# Altium schematic sheet smartGarden_Per_Rev01.SchDoc
size A
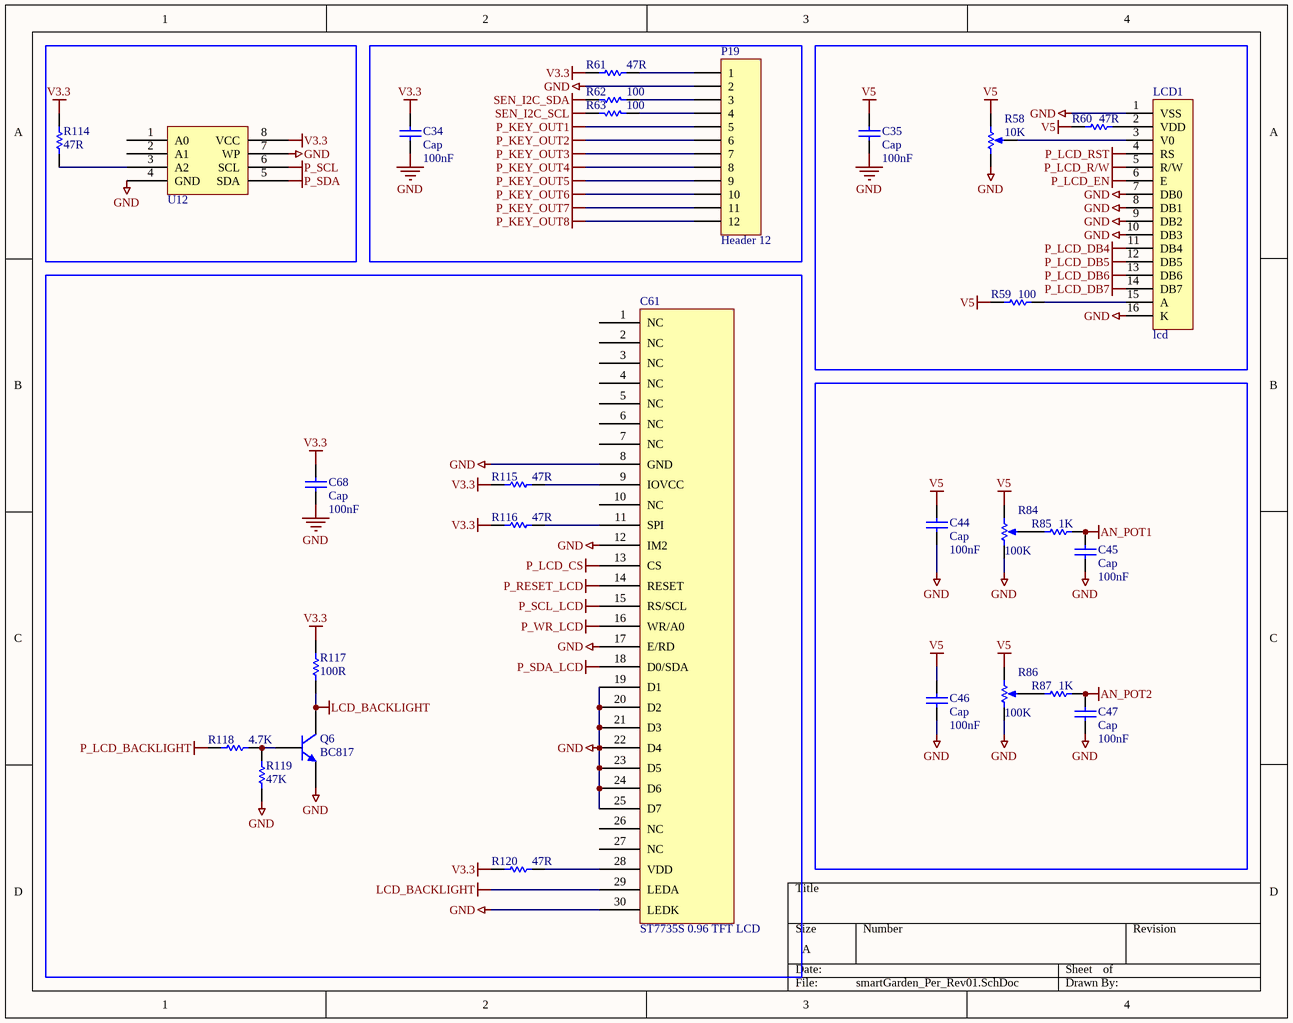
[diagram p0: smartGarden_Per_Rev01.SchDoc]

## Parts
C34  Cap  value 100nF  [0805_smd]
C35  Cap  value 100nF  [0805_smd]
C44  Cap  value 100nF  [0805_smd]
C45  Cap  value 100nF  [0805_smd]
C46  Cap  value 100nF  [0805_smd]
C47  Cap  value 100nF  [0805_smd]
C61  ST7735S 0.96 TFT LCD
C68  Cap  value 100nF  [0805_smd]
LCD1  lcd  [LCD2*16]
P19  Header 12  [CON12_XH]
Q6  BC817  [TO-226-AA]
R58  value 10K  [Trimmer Pot]  (hidden comment: RPot)
R59  100  [0805_smd]
R60  47R  [0805_smd]
R61  47R  [0805_smd]
R62  100  [0805_smd]
R63  100  [0805_smd]
R84  value 100K  [POT_V15]  (hidden comment: RPot)
R85  1K  [0805_smd]
R86  value 100K  [POT_V15]  (hidden comment: RPot)
R87  1K  [0805_smd]
R114  47R  [0805_smd]
R115  47R  [0805_smd]
R116  47R  [0805_smd]
R117  100R  [0805_smd]
R118  4.7K  [0805_smd]
R119  47K  [0805_smd]
R120  47R  [0805_smd]
U12  AT24C08  [SOIC8]  (value not drawn)

## Nets
AN_POT1: C45.2 R85.1
AN_POT2: C47.2 R87.1
GND: C34.1 C35.1 C44.1 C45.1 C46.1 C47.1 C61.8(GND) C61.12(IM2) C61.17(E/RD) C61.19(D1) C61.20(D2) C61.21(D3) C61.22(D4) C61.23(D5) C61.24(D6) C61.25(D7) C61.30(LEDK) C68.1 LCD1.1(VSS) LCD1.7(DB0) LCD1.8(DB1) LCD1.9(DB2) LCD1.10(DB3) LCD1.16(K) P19.2 Q6.3(E) R58.1(TOP) R84.1(TOP) R86.1(TOP) R119.2 U12.4(GND) U12.7(WP)
LCD_BACKLIGHT: C61.29(LEDA) Q6.1(C) R117.1
P_KEY_OUT1: P19.5
P_KEY_OUT2: P19.6
P_KEY_OUT3: P19.7
P_KEY_OUT4: P19.8
P_KEY_OUT5: P19.9
P_KEY_OUT6: P19.10
P_KEY_OUT7: P19.11
P_KEY_OUT8: P19.12
P_LCD_BACKLIGHT: R118.2
P_LCD_CS: C61.13(CS)
P_LCD_DB4: LCD1.11(DB4)
P_LCD_DB5: LCD1.12(DB5)
P_LCD_DB6: LCD1.13(DB6)
P_LCD_DB7: LCD1.14(DB7)
P_LCD_EN: LCD1.6(E)
P_LCD_R/W: LCD1.5(R/W)
P_LCD_RST: LCD1.4(RS)
P_RESET_LCD: C61.14(RESET)
P_SCL: U12.6(SCL)
P_SCL_LCD: C61.15(RS/SCL)
P_SDA: U12.5(SDA)
P_SDA_LCD: C61.18(D0/SDA)
P_WR_LCD: C61.16(WR/A0)
SEN_I2C_SCL: R63.1
SEN_I2C_SDA: R62.1
V3.3: C34.2 C68.2 R61.2 R114.1 R115.2 R116.2 R117.2 R120.2 U12.8(VCC)
V5: C35.2 C44.2 C46.2 R58.2(BOT) R59.2 R60.2 R84.2(BOT) R86.2(BOT)
NetC61_9: C61.9(IOVCC) R115.1
NetC61_11: C61.11(SPI) R116.1
NetC61_28: C61.28(VDD) R120.1
NetLCD1_2: LCD1.2(VDD) R60.1
NetLCD1_3: LCD1.3(V0) R58.3(TAP)
NetLCD1_15: LCD1.15(A) R59.1
NetP19_1: P19.1 R61.1
NetP19_3: P19.3 R62.2
NetP19_4: P19.4 R63.2
NetQ6_2: Q6.2(B) R118.1 R119.1
NetR84_3: R84.3(TAP) R85.2
NetR86_3: R86.3(TAP) R87.2
NetR114_2: R114.2 U12.3(A2)

Not connected (* = marked no-connect by the designer): C61 1(NC) 2(NC) 3(NC) 4(NC) 5(NC) 6(NC) 7(NC) 10(NC) 26(NC) 27(NC); U12 1(A0) 2(A1)

## Library data of the parts
C34 C35 C44-C47 C68 = Cap: Capacitor; Published: 8-Jun-2000; LatestRevisionDate: 17-Jul-2002; LatestRevisionNote: Re-released for DXP Platform.; PackageReference: RAD-0.3; Publisher: Altium Limited; PackageDescription: Radial Cap, Thru-Hole; 2 Leads; 0.3 in Pin Spacing
LCD1 = LCD16
P19 = Header 12: Header, 12-Pin; LatestRevisionDate: 17-Jul-2002; LatestRevisionNote: Re-released for DXP Platform.; Publisher: Altium Limited
Q6 = NPN: NPN Bipolar Transistor; Published: 8-Jun-2000; LatestRevisionDate: 17-Jul-2002; LatestRevisionNote: Re-released for DXP Platform.; PackageReference: TO-226-AA; Publisher: Altium Limited; PackageDescription: TO, Flat Index; 3 In-Line, Axial Leads; Body Dia. 4.8mm; Leads 0.55 x 0.51 mm (max); Code_JEDEC: TO-226-AA
R58 R84 R86 = RPot: Potentiometer; Sim Note: Enter the Resistance value and the set point into parameter fields.; Set Position: 0.5; Published: 8-Jun-2000; LatestRevisionDate: 17-Jul-2002; LatestRevisionNote: Re-released for DXP Platform.; PackageReference: VR5; Publisher: Altium Limited; PackageDescription: Variable Resistor, Thru-Hole; 3 Leads
R59-R61 R114-R120 = Res Semi: Semiconductor Resistor; Value: 1k; Published: 8-Jun-2000; LatestRevisionDate: 17-Jul-2002; LatestRevisionNote: Re-released for DXP Platform.; PackageReference: AXIAL-0.5; Publisher: Altium Limited
R62 R63 = Res1: Resistor; Published: 8-Jun-2000; LatestRevisionDate: 17-Jul-2002; LatestRevisionNote: Re-released for DXP Platform.; PackageReference: AXIAL-0.3; Publisher: Altium Limited
R85 R87 = Res Semi: Semiconductor Resistor; Published: 8-Jun-2000; LatestRevisionDate: 17-Jul-2002; LatestRevisionNote: Re-released for DXP Platform.; PackageReference: AXIAL-0.5; Publisher: Altium Limited; Value: 1k